# Altium schematic sheet MP3.SchDoc
size A3
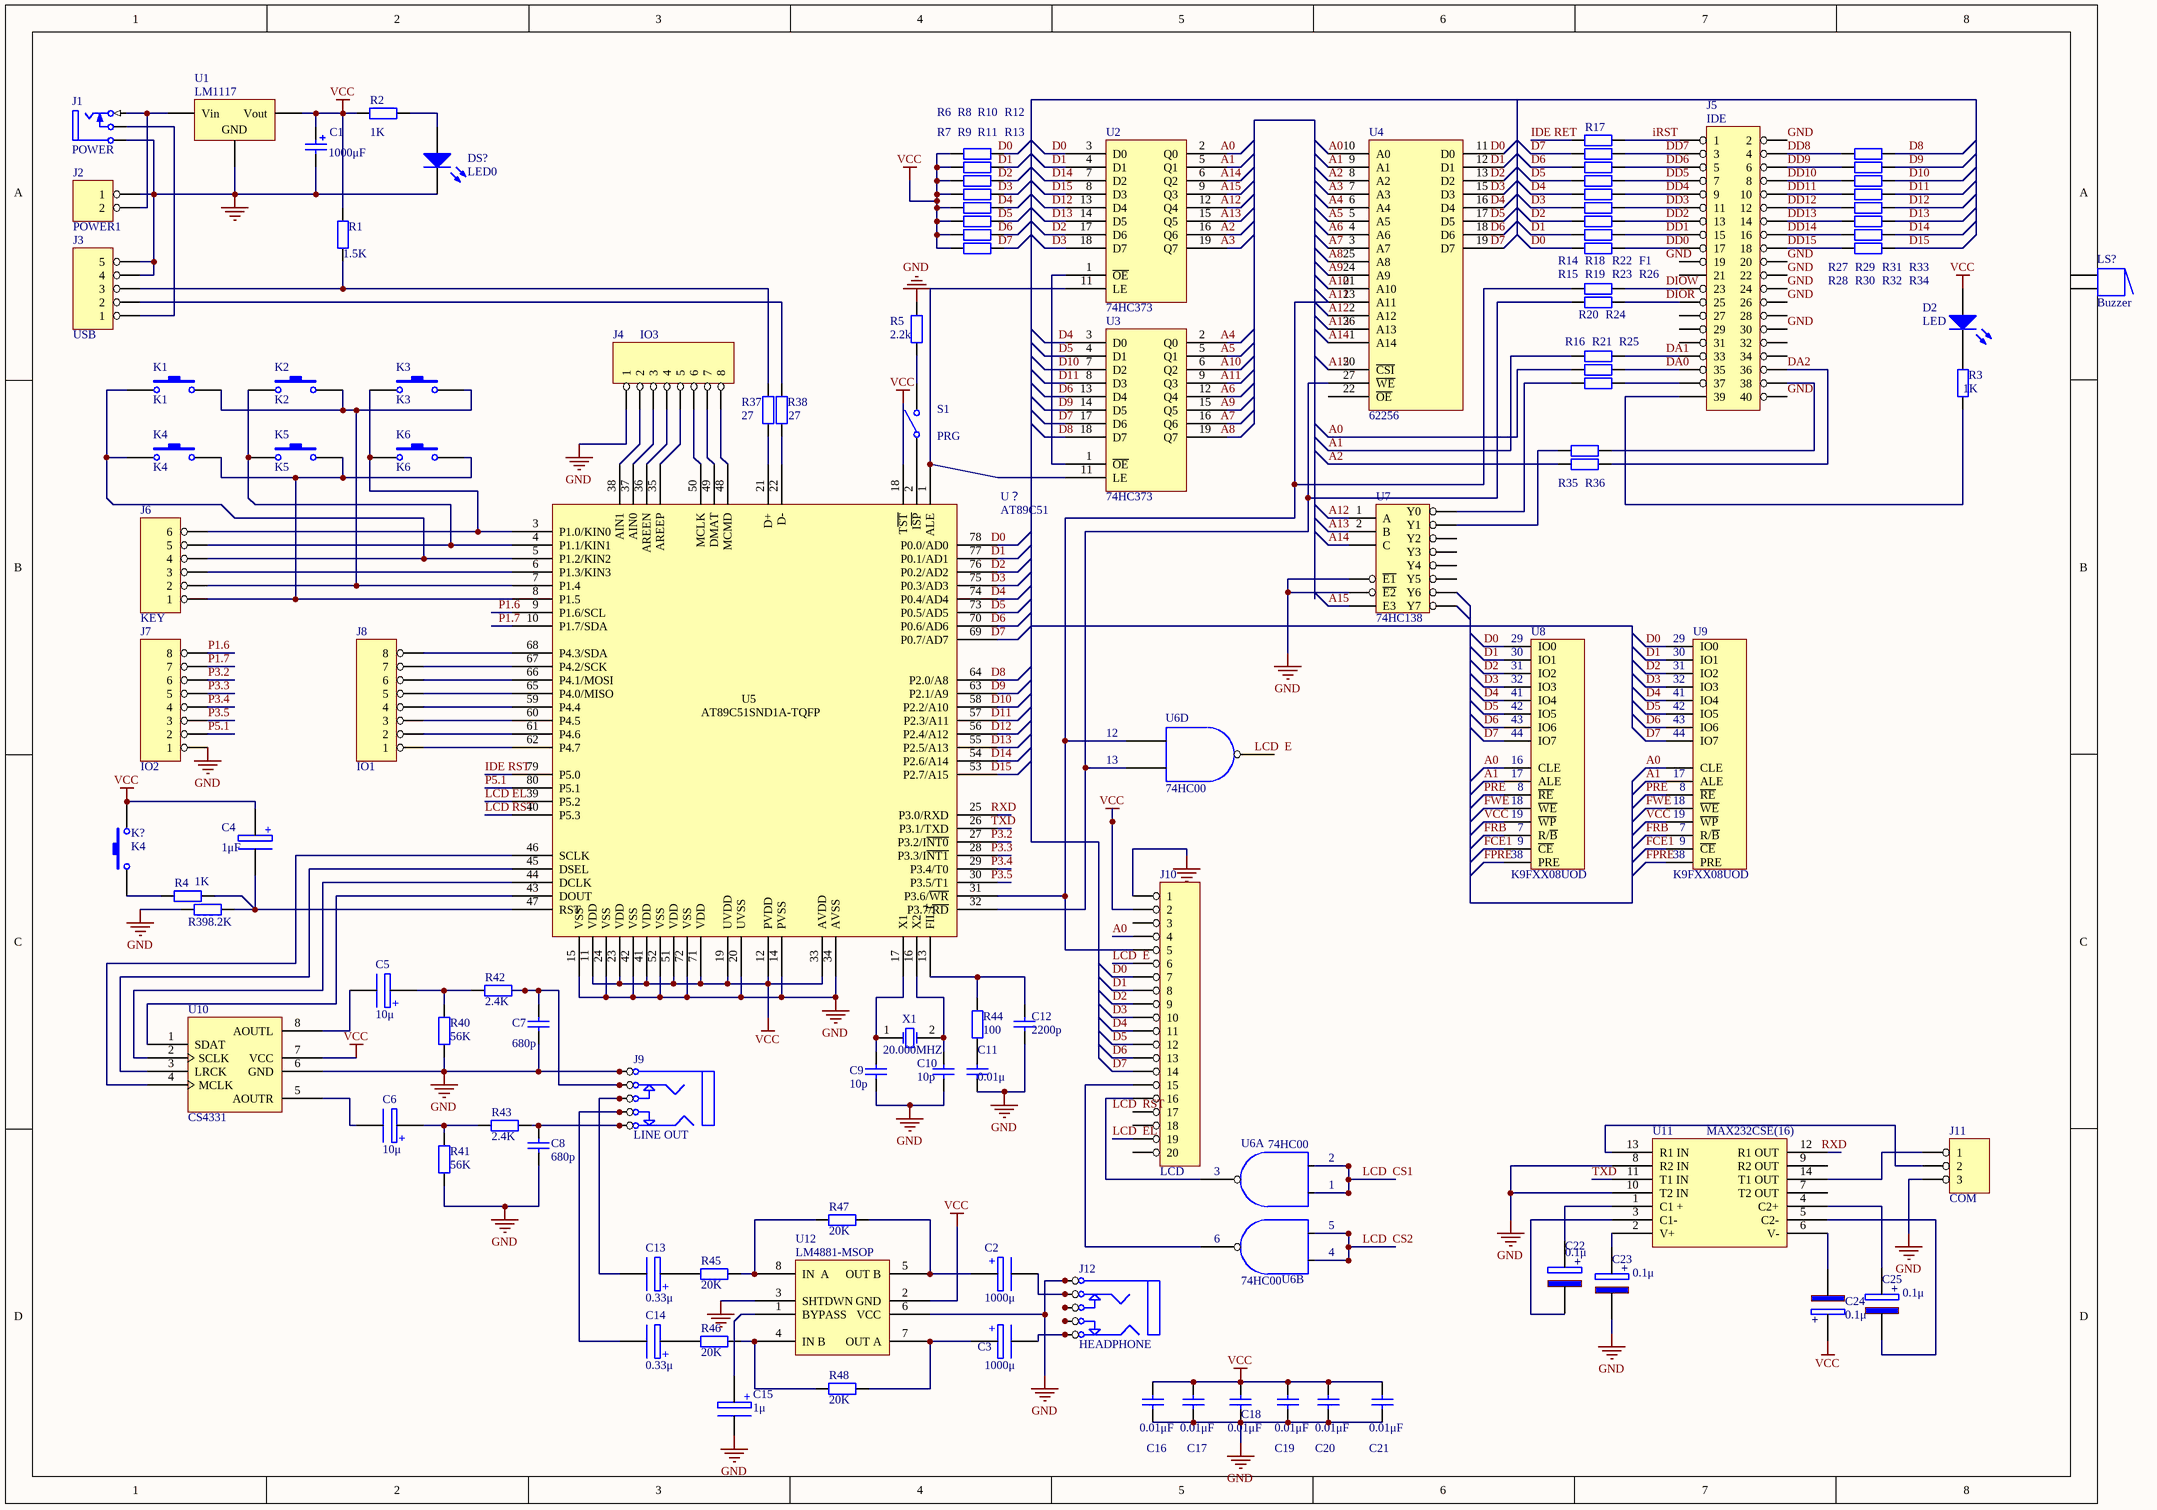
[diagram p0: MP3.SchDoc]

## Parts
1  C1  value 1000μF  [CAPPA14.05-10.5x6.3]
C2  1000μ  [cap]
C3  1000μ  [cap]
C4  1μF  [cap]
C5  10μ  [cap]
C6  10μ  [cap]
C7  680p  [CAPR2.54-5.1x3.2]
C8  680p  [CAPR2.54-5.1x3.2]
C9  10p  [CAPR2.54-5.1x3.2]
C10  10p  [CAPR2.54-5.1x3.2]
C11  0.01μ  [CAPR2.54-5.1x3.2]
C12  2200p  [CAPR2.54-5.1x3.2]
C13  0.33μ  [cap]
C14  0.33μ  [cap]
C15  1μ  [cap]
C16  value 0.01μF  [CAPR2.54-5.1x3.2]  (hidden comment: 2200p)
C17  value 0.01μF  [CAPR2.54-5.1x3.2]  (hidden comment: 2200p)
C18  value 0.01μF  [CAPR2.54-5.1x3.2]  (hidden comment: 2200p)
C19  value 0.01μF  [CAPR2.54-5.1x3.2]  (hidden comment: 2200p)
C20  value 0.01μF  [CAPR2.54-5.1x3.2]  (hidden comment: 2200p)
C21  value 0.01μF  [CAPR2.54-5.1x3.2]  (hidden comment: 2200p)
C22  0.1μ  [cap]
C23  0.1μ  [cap]
C24  0.1μ  [cap]
C25  0.1μ  [cap]
D2  LED  [LED-0]
DS?  LED0  [LED-0]
F1  Res2  [AXIAL-0.4]  (value not drawn)
J1  POWER  [JACK/6-V3A]
J2  POWER1  [HDR1X2H]
J3  USB  [HDR1X5]
J4  IO3  [HDR1X8]
J5  IDE  [HDR2X20]
J6  KEY  [HDR1X6]
J7  IO2  [HDR1X8]
J8  IO1  [HDR1X8]
J9  LINE OUT  [ST-3150-5N]
J10  LCD  [HDR1X20]
J11  COM  [MHDR1X3]
J12  HEADPHONE  [ST-3150-5N]
K1  K1  [SPST-2]
K2  K2  [SPST-2]
K3  K3  [SPST-2]
K4  K4  [SPST-2]
K5  K5  [SPST-2]
K6  K6  [SPST-2]
K?  K4  [SPST-2]
LS?  Buzzer  [ABSM-1574]
R1  value 1.5K  [AXIAL-0.4]  (hidden comment: Res2)
R2  value 1K  [AXIAL-0.4]  (hidden comment: Res2)
R3  value 1K  [AXIAL-0.4]  (hidden comment: Res2)
R4  1K  [AXIAL-0.4]
R5  value 2.2k  [AXIAL-0.4]  (hidden comment: Res2)
R6  Res2  [AXIAL-0.4]  (value not drawn)
R7  Res2  [AXIAL-0.4]  (value not drawn)
R8  Res2  [AXIAL-0.4]  (value not drawn)
R9  Res2  [AXIAL-0.4]  (value not drawn)
R10  Res2  [AXIAL-0.4]  (value not drawn)
R11  Res2  [AXIAL-0.4]  (value not drawn)
R12  Res2  [AXIAL-0.4]  (value not drawn)
R13  Res2  [AXIAL-0.4]  (value not drawn)
R14  Res2  [AXIAL-0.4]  (value not drawn)
R15  Res2  [AXIAL-0.4]  (value not drawn)
R16  Res2  [AXIAL-0.4]  (value not drawn)
R17  Res2  [AXIAL-0.4]  (value not drawn)
R18  Res2  [AXIAL-0.4]  (value not drawn)
R19  Res2  [AXIAL-0.4]  (value not drawn)
R20  Res2  [AXIAL-0.4]  (value not drawn)
R21  Res2  [AXIAL-0.4]  (value not drawn)
R22  Res2  [AXIAL-0.4]  (value not drawn)
R23  Res2  [AXIAL-0.4]  (value not drawn)
R24  Res2  [AXIAL-0.4]  (value not drawn)
R25  Res2  [AXIAL-0.4]  (value not drawn)
R26  Res2  [AXIAL-0.4]  (value not drawn)
R27  Res2  [AXIAL-0.4]  (value not drawn)
R28  Res2  [AXIAL-0.4]  (value not drawn)
R29  Res2  [AXIAL-0.4]  (value not drawn)
R30  Res2  [AXIAL-0.4]  (value not drawn)
R31  Res2  [AXIAL-0.4]  (value not drawn)
R32  Res2  [AXIAL-0.4]  (value not drawn)
R33  Res2  [AXIAL-0.4]  (value not drawn)
R34  Res2  [AXIAL-0.4]  (value not drawn)
R35  Res2  [AXIAL-0.4]  (value not drawn)
R36  Res2  [AXIAL-0.4]  (value not drawn)
R37  27  [AXIAL-0.4]
R38  value 27  [AXIAL-0.4]  (hidden comment: Res2)
R39  27: 8.2K  [AXIAL-0.4]  (hidden comment: 27)
R40  56K  [AXIAL-0.4]
R41  56K  [AXIAL-0.4]
R42  2.4K  [AXIAL-0.4]
R43  2.4K  [AXIAL-0.4]
R44  100  [AXIAL-0.4]
R45  20K  [AXIAL-0.4]
R46  20K  [AXIAL-0.4]
R47  20K  [AXIAL-0.4]
R48  20K  [AXIAL-0.4]
S1  PRG  [SPST-2]
U1  LM1117  [SIP-G3/Y2]
U2  74HC373  [74HC373]
U3  74HC373  [74HC373]
U4  62256  [SOJ127P870X356-26M]
U6A  74HC00  [74HC00]
U6B  74HC00  [74HC00]
U6D  74HC00  [74HC00]
U7  74HC138  [HDR2X7]
U8  K9FXX08UOD  [U8]
U9  K9FXX08UOD  [U8]
U10  CS4331  [CS4331]
U11  MAX232CSE(16)  [U11]
U12  LM4881-MSOP  [CS4331]
U？  AT89C51  [QFP65P1720X2320X245-100M]
X1  20.000MHZ  [BCY-W2/D3.1]

## Nets
GND: 1.2 C7.1 C8.1 C9.1 C10.1 C11.1 C12.1 C16.1 C17.1 C18.1 C19.1 C20.1 C21.1 C23.0 DS?.2(K) J1.5(S) J2.1 J3.4 J3.5 J4.1 J5.2 J5.20 J5.22 J5.24 J5.26 J5.30 J5.40 J7.1 J9.1 J9.1A J9.1B J10.1 J11.3 J12.1 J12.1A J12.1B R5.2 R39.2 R40.2 R41.2 U1.2(GND) U7.4(~{E1}) U7.5(~{E2}) U10.6(GND) U11.8(R2_IN) U11.10(T2_IN) U12.3(SHTDWN) U12.6(VCC) U？.14(PVSS) U？.15(VSS) U？.20(UVSS) U？.24(VSS) U？.34(AVSS) U？.42(VSS) U？.52(VSS) U？.72(VSS)
VCC: 1.1 C4.1 C16.2 C17.2 C18.2 C19.2 C20.2 C21.2 C24.1 D2.1(A) J10.2 K?.2 R1.2 R2.1 R6.1 R7.1 R8.1 R9.1 R10.1 R11.1 R12.1 R13.1 U1.3(Vout) U8.25(~{WP}) U9.25(~{WP}) U10.7(VCC) U12.2(GND) U？.11(VDD) U？.12(PVDD) U？.18(T~{ST}) U？.19(UVDD) U？.23(VDD) U？.33(AVDD) U？.41(VDD) U？.51(VDD) U？.71(VDD)
A0: J10.4 R21.1 U4.10(A0) U8.17(CLE) U9.17(CLE)
A1: R16.1 U4.9(A1) U8.19(ALE) U9.19(ALE)
A2: R36.1 U4.8(A2)
A3: U4.7(A3)
A4: U4.6(A4)
A5: U4.5(A5)
A6: U4.4(A6)
A7: U4.3(A7)
A8: U4.25(A8)
A9: U4.24(A9)
A10: U4.21(A10)
A11: J10.5 R20.1 U4.23(A11) U6D.3 U？.31(P3.6/~{WR})
A12: U4.2(A12) U7.1(A)
A13: U4.26(A13) U7.2(B)
A14: U4.1(A14) U7.3(C)
A15: U4.20(~{CSI}) U7.6(E3)
D0: J10.7 R26.1 U2.3(D0) U8.1(IO0) U9.1(IO0)
D1: F1.1 J10.8 U2.4(D1) U8.3(IO1) U9.3(IO1)
D2: J10.9 R23.1 U2.17(D6) U8.5(IO2) U9.5(IO2)
D3: J10.10 R22.1 U2.18(D7) U8.7(IO3) U9.7(IO3)
D4: J10.11 R19.1 U3.3(D0) U8.9(IO4) U9.9(IO4)
D5: J10.12 R18.1 U3.4(D1) U8.11(IO5) U9.11(IO5)
D6: J10.13 R15.1 U3.13(D4) U8.13(IO6) U9.13(IO6)
D7: J10.14 R14.1 U3.17(D6) U8.15(IO7) U9.15(IO7)
D8: R27.2 U3.18(D7)
D9: R28.2 U3.14(D5)
D10: R29.2 U3.7(D2)
D11: R30.2 U3.8(D3)
D12: R31.2 U2.13(D4)
D13: R32.2 U2.14(D5)
D14: R33.2 U2.7(D2)
D15: R34.2 U2.8(D3)
DA0: J5.35 R21.2
DA1: J5.33 R16.2
DA2: J5.36 R36.2
DD0: J5.17 R26.2
DD1: F1.2 J5.15
DD2: J5.13 R23.2
DD3: J5.11 R22.2
DD4: J5.9 R19.2
DD5: J5.7 R18.2
DD6: J5.5 R15.2
DD7: J5.3 R14.2
DD8: J5.4 R27.1
DD9: J5.6 R28.1
DD10: J5.8 R29.1
DD11: J5.10 R30.1
DD12: J5.12 R31.1
DD13: J5.14 R32.1
DD14: J5.16 R33.1
DD15: J5.18 R34.1
DIOR: J5.25 R24.2
DIOW: J5.23 R20.2
FCE1: U8.29(~{CE}) U9.29(~{CE})
FPRE: U8.31(PRE) U9.31(PRE)
FRB: U8.27(R/~{B}) U9.27(R/~{B})
FWE: U8.23(~{WE}) U9.23(~{WE})
IDE RET: R17.1
IDE RST: U？.79(P5.0)
iRST: J5.1 R17.2
LCD  CS1: U6A.2 U6A.3
LCD  CS2: U6B.2 U6B.3
LCD  E: J10.6
LCD  EL: J10.19
LCD EL: U？.39(P5.2)
LCD RST: U？.40(P5.3)
P1.6: J7.8 U？.9(P1.6/SCL)
P1.7: J7.7 U？.10(P1.7/SDA)
P3.2: J7.6
P3.3: J7.5
P3.4: J7.4
P3.5: J7.3
P5.1: J7.2 U？.80(P5.1)
PRE: U8.21(~{RE}) U9.21(~{RE})
TXD: U11.11(T1_IN)
NetC2_0: C2.0 J12.2 J12.2A J12.2B
NetC2_1: C2.1 R47.2 U12.5(OUT_B)
NetC3_0: C3.0 J12.4 J12.4A J12.4B
NetC3_1: C3.1 R48.2 U12.7(OUT_A)
NetC4_0: C4.0 R4.1 R39.1 U？.47(RST)
NetC5_0: C5.0 U10.8(AOUTL)
NetC5_1: C5.1 R40.1 R42.1
NetC6_0: C6.0 U10.5(AOUTR)
NetC6_1: C6.1 R41.1 R43.1
NetC7_2: C7.2 J9.2 J9.2A J9.2B R42.2
NetC8_2: C8.2 J9.4 J9.4A J9.4B R43.2
NetC9_2: C9.2 U？.17(X1) X1.1(OSC1)
NetC10_2: C10.2 U？.16(X2) X1.2(OSC2)
NetC11_2: C11.2 R44.1
NetC12_2: C12.2 R44.2 U？.13(FILT)
NetC13_0: C13.0 J9.5 J9.5A J9.5B
NetC13_1: C13.1 R45.1
NetC14_0: C14.0 J9.3 J9.3A J9.3B
NetC14_1: C14.1 R46.1
NetC15_1: C15.1 U12.1(BYPASS)
NetC22_1: C22.1 U11.1(C1_+)
NetC23_1: C23.1 U11.2(V+)
NetC24_0: C24.0 U11.6(V-)
NetC25_0: C25.0 U11.5(C2-)
NetC25_1: C25.1 U11.4(C2+)
NetD2_2: D2.2(K) R3.2
NetDS?_1: DS?.1(A) R2.2
NetJ1_1: J1.1(T) J2.2 U1.1(Vin)
NetJ1_2: J1.2(TN) J3.1
NetJ3_2: J3.2 R38.2
NetJ3_3: J3.3 R1.1 R37.2
NetJ4_2: J4.2 U？.38(AIN1)
NetJ4_3: J4.3 U？.37(AIN0)
NetJ4_4: J4.4 U？.36(AREEN)
NetJ4_5: J4.5 U？.35(AREEP)
NetJ4_6: J4.6 U？.50(MCLK)
NetJ4_7: J4.7 U？.49(DMAT)
NetJ4_8: J4.8 U？.48(MCMD)
NetJ5_37: J5.37 R25.2
NetJ5_38: J5.38 R35.2
NetJ5_39: J5.39 R3.1
NetJ6_1: J6.1 K4.2 K5.2 K6.2 U？.8(P1.5)
NetJ6_2: J6.2 K1.2 K2.2 K3.2 U？.7(P1.4)
NetJ6_3: J6.3 U？.6(P1.3/KIN3)
NetJ6_4: J6.4 K1.1 K4.1 U？.5(P1.2/KIN2)
NetJ6_5: J6.5 K2.1 K5.1 U？.4(P1.1/KIN1)
NetJ6_6: J6.6 K3.1 K6.1 U？.3(P1.0/KIN0)
NetJ8_1: J8.1 U？.62(P4.7)
NetJ8_2: J8.2 U？.61(P4.6)
NetJ8_3: J8.3 U？.60(P4.5)
NetJ8_4: J8.4 U？.59(P4.4)
NetJ8_5: J8.5 U？.65(P4.0/MISO)
NetJ8_6: J8.6 U？.66(P4.1/MOSI)
NetJ8_7: J8.7 U？.67(P4.2/SCK)
NetJ8_8: J8.8 U？.68(P4.3/SDA)
NetJ10_15: J10.15 U6B.1
NetJ10_16: J10.16 U6A.1
NetJ11_1: J11.1 U11.14(T1_OUT)
NetJ11_2: J11.2 U11.13(R1_IN)
NetJ12_3: J12.3 J12.3A J12.3B
NetJ12_5: J12.5 J12.5A J12.5B
NetK?_1: K?.1 R4.2
NetLS?_1: LS?.1 LS?.1A
NetLS?_2: LS?.2 LS?.2A
NetR5_1: R5.1 S1.2(NO)
NetR24_1: R24.1 U4.27(~{WE}) U6D.2 U？.32(P3.7/~{RD})
NetR25_1: R25.1 U7.10(Y0)
NetR35_1: R35.1 U7.14(Y1)
NetR37_1: R37.1 U？.21(D+)
NetR38_1: R38.1 U？.22(D-)
NetR45_2: R45.2 R47.1 U12.8(IN__A)
NetR46_2: R46.2 R48.1 U12.4(IN_B)
NetS1_1: S1.1(COMMON) U？.2(I~{SP})
NetU2_1: U2.1(~{OE}) U3.1(~{OE})
NetU2_11: U2.11(LE) U3.11(LE) U？.1(ALE)
NetU10_1: U10.1(SDAT) U？.43(DOUT)
NetU10_2: U10.2(SCLK) U？.44(DCLK)
NetU10_3: U10.3(LRCK) U？.45(DSEL)
NetU10_4: U10.4(MCLK) U？.46(SCLK)

Not connected (* = marked no-connect by the designer): C15 0(9); C22 0; J5 19 21 27 28 29 31 32 34; J10 3 17 18 20; R6 2; R7 2; R8 2; R9 2; R10 2; R11 2; R12 2; R13 2; U2 2(Q0) 5(Q1) 6(Q2) 9(Q3) 12(Q4) 15(Q5) 16(Q6) 19(Q7); U3 2(Q0) 5(Q1) 6(Q2) 9(Q3) 12(Q4) 15(Q5) 16(Q6) 19(Q7); U4 11(D0) 12(D1) 13(D2) 15(D3) 16(D4) 17(D5) 18(D6) 19(D7) 22(~{OE}); U6D 1; U7 7(Y7) 8(Y6) 9(Y5) 11(Y4) 12(Y3) 13(Y2); U11 3(C1-) 7(T2_OUT) 9(R2_OUT) 12(R1_OUT); U？ 25(P3.0/RXD) 26(P3.1/TXD) 27(P3.2/I~{NT0}) 28(P3.3/I~{NT1}) 29(P3.4/T0) 30(P3.5/T1) 53(P2.7/A15) 54(P2.6/A14) 55(P2.5/A13) 56(P2.4/A12) 57(P2.3/A11) 58(P2.2/A10) 63(P2.1/A9) 64(P2.0/A8) 69(P0.7/AD7) 70(P0.6/AD6) 73(P0.5/AD5) 74(P0.4/AD4) 75(P0.3/AD3) 76(P0.2/AD2) 77(P0.1/AD1) 78(P0.0/AD0)

## Notes on the sheet
- (near U8) 29
- (near U9) 29
- (near U8) 30
- (near U8) 31
- (near U8) 32
- (near U8) 41
- (near U8) 42
- (near U8) 43
- (near U9) 30
- (near U9) 31
- (near U9) 32
- (near U9) 41
- (near U9) 42
- (near U9) 43
- (near U6D) 12
- (near U6D) 13
- (near U8) 44
- (near U8) 16
- (near U8) 17
- (near U9) 44
- (near U9) 17
- (near U8) 18
- (near U8) 19
- (near U8) 38
- (near U8) 8
- (near U8) 9
- (near U8) 7
- (near U9) 18
- (near U9) 19
- (near U9) 38
- (near U9) 8
- (near U9) 9
- (near U9) 7
- (near U6A) 3
- (near U6A) 1
- (near U6A) 2
- (near U6B) 6
- (near U6B) 4
- 5
- Labels drawn without touching a wire or pin: A0, A1, A2, A3, A4, A5, A6, A7, A8, A9, A10, A11, A12, A13, A14, A15, D0, D1, D2, D3, D4, D5, D6, D7, D8, D9, D10, D11, D12, D13, D14, D15, GND, LCD  E, LCD  RST, P3.2, P3.3, P3.4, P3.5, RXD, TXD
- (in symbol AT89C51) U5; AT89C51SND1A-TQFP
- (in symbol Cap) +
- (in symbol CAP1) +

## Library data of the parts
1 = Cap Pol2: Polarized Capacitor (Axial); Published: 8-Jun-2000; LatestRevisionDate: 17-Jul-2002; LatestRevisionNote: Re-released for DXP Platform.; Publisher: Altium Limited
C2-C6 C13-C15 = CAP1
C7-C12 = Cap: Capacitor; Value: 100pF; Published: 8-Jun-2000; LatestRevisionDate: 17-Jul-2002; LatestRevisionNote: Re-released for DXP Platform.; Publisher: Altium Limited
C16-C21 = Cap: Capacitor; Published: 8-Jun-2000; LatestRevisionDate: 17-Jul-2002; LatestRevisionNote: Re-released for DXP Platform.; Publisher: Altium Limited
C22-C25 = Cap
D2 DS? = LED0: Typical INFRARED GaAs LED; Published: 8-Jun-2000; LatestRevisionDate: 17-Jul-2002; LatestRevisionNote: Re-released for DXP Platform.; Publisher: Altium Limited
F1 R6-R36 = Res2: Resistor; Value: 1K; Published: 8-Jun-2000; LatestRevisionDate: 17-Jul-2002; LatestRevisionNote: Re-released for DXP Platform.; Publisher: Altium Limited
J1 = Phonejack2 TN: Jack Socket, 1/4" [6.5mm], Thru-Hole, Vertical, 2-Conductor with Tip closed; PackageDocument: 2003; PCB_Layout: Complies with manufacturer's recommendation.; DrillAndSlotSize: Corresponds to nominal value.; LatestRevisionDate: 15-Jul-2004; LatestRevisionNote: Component Replaced & renamed from "Phonejack".; DatasheetDocument: 2003; PackageReference: S1VS_SNB; Publisher: Altium Limited
J2 = Header 2H: Header, 2-Pin, Right Angle; LatestRevisionDate: 17-Jul-2002; LatestRevisionNote: Re-released for DXP Platform.; Publisher: Altium Limited
J3 = Header 5: Header, 5-Pin; LatestRevisionDate: 17-Jul-2002; LatestRevisionNote: Re-released for DXP Platform.; Publisher: Altium Limited
J4 J7 J8 = Header 8: Header, 8-Pin; LatestRevisionDate: 17-Jul-2002; LatestRevisionNote: Re-released for DXP Platform.; Publisher: Altium Limited
J5 = Header 20X2: Header, 20-Pin, Dual row; LatestRevisionDate: 17-Jul-2002; LatestRevisionNote: Re-released for DXP Platform.; Publisher: Altium Limited
J6 = Header 6: Header, 6-Pin; LatestRevisionDate: 17-Jul-2002; LatestRevisionNote: Re-released for DXP Platform.; Publisher: Altium Limited
J9 J12 = Phonejack Stereo SW: 3-Conductor Jack with 2 break contacts (normals) and 2 auxiliary make contacts; Published: 5-Jan-2004; LatestRevisionDate: 17-Dec-2003; LatestRevisionNote: PCB Footprint replaced.; DatasheetDocument: 07-Mar-2000; Publisher: Altium Limited
J10 = Header 20: Header, 20-Pin; LatestRevisionDate: 17-Jul-2002; LatestRevisionNote: Re-released for DXP Platform.; Publisher: Altium Limited
J11 = MHDR1X3: Header, 3-Pin; LatestRevisionDate: 17-Jul-2002; LatestRevisionNote: Re-released for DXP Platform.; Publisher: Altium Limited
K1-K6 K? = SW-PB: Switch; Published: 24-Mar-1999; LatestRevisionDate: 17-Jul-2002; LatestRevisionNote: Re-released for DXP Platform.; Publisher: Altium Limited
LS? = Buzzer: Magnetic Transducer Buzzer; Published: 24-Mar-1999; LatestRevisionDate: 17-Dec-2003; LatestRevisionNote: Schematic revised, PCB Footprint replaced.; DatasheetDocument: 17-Dec-2003; Publisher: Altium Limited
R1-R5 R37-R48 = Res2: Resistor; Published: 8-Jun-2000; LatestRevisionDate: 17-Jul-2002; LatestRevisionNote: Re-released for DXP Platform.; Publisher: Altium Limited
  R4 R37 R40-R48: 27: 27
S1 = SW-SPST: Single-Pole, Single-Throw Switch; Published: 24-Mar-1999; LatestRevisionDate: 17-Jul-2002; LatestRevisionNote: Re-released for DXP Platform.; Publisher: Altium Limited
U1 = Volt Reg: Voltage Regulator; Published: 24-Mar-1999; LatestRevisionDate: 17-Jul-2002; LatestRevisionNote: Re-released for DXP Platform.; Publisher: Altium Limited; Code_JEDEC: SMD-220
U2 U3 = U?
U7 = Header 7X2: Header, 7-Pin, Dual row; LatestRevisionDate: 17-Jul-2002; LatestRevisionNote: Re-released for DXP Platform.; Publisher: Altium Limited
U8 U9 = MHDR2X16: Header, 16-Pin, Dual row; LatestRevisionDate: 17-Jul-2002; LatestRevisionNote: Re-released for DXP Platform.; Publisher: Altium Limited
U11 = U11
U12 = CS4331
X1 = XTAL: Crystal Oscillator; Published: 8-Jun-2000; LatestRevisionDate: 17-Jul-2002; LatestRevisionNote: Re-released for DXP Platform.; Publisher: Altium Limited